# EAGLE design w_projectTQFP2 (EAGLE 6.3)
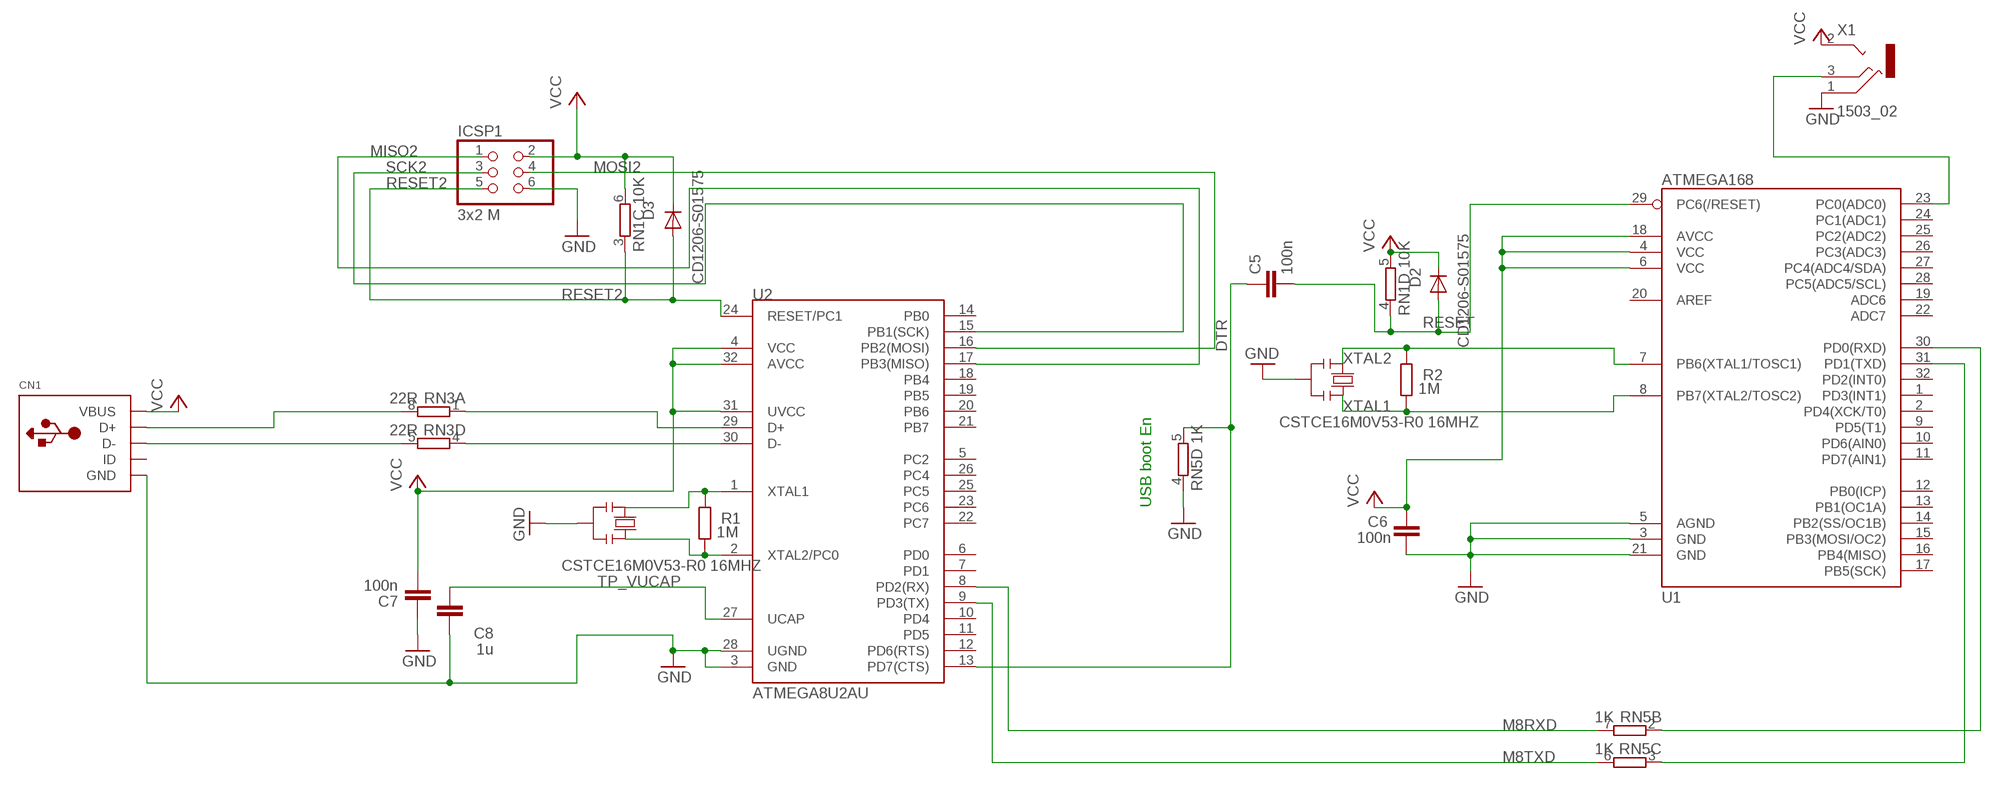
[diagram p0: schematic, sheet 1]

## Parts
C5  100n  C-EU0603-RND  [C0603-ROUND]
C6  100n  C-EU0603-RND  [C0603-ROUND]
C7  100n  C-EU0603-RND  [C0603-ROUND]
C8  1u  C-EU0603-RND  [C0603-ROUND]
CN1  USBMINIB  [USB-MINIB]
D2  CD1206-S01575  DIODE-MINIMELF  [MINIMELF]
D3  CD1206-S01575  DIODE-MINIMELF  [MINIMELF]
ICSP1  3x2 M  PINHD-2X3  [2X03]
R1  1M  R-EU_R0603  [R0603-ROUND]
R2  1M  R-EU_R0603  [R0603-ROUND]
RN1  10K  4R-NCAY16  [CAY16]
RN3  22R  4R-NCAY16  [CAY16]
RN5  1K  4R-NCAY16  [CAY16]
U1  ATMEGA168  [TQFP32-08]
U2  ATMEGA8U2AU  [TQFP32-08]
X1  1503_02  [1503_02]
Y2  CSTCE16M0V53-R0 16MHZ  RESONATORMU  [RESONATOR]
Y4  CSTCE16M0V53-R0 16MHZ  RESONATORMU  [RESONATOR]

## Nets
D+: CN1.D+ RN3.8
DTR: C5.1 RN5.5 U2.13(PD7(CTS))
GND [gnd]: C6.1 C7.2 C8.2 CN1.GND ICSP1.6 RN5.4 U1.3(GND) U1.5(AGND) U1.21(GND) U2.3(GND) U2.28(UGND) X1.1 Y2.2 Y4.2
IO1: RN5.3 U1.31(PD1(TXD))
M8RXD: RN5.7 U2.8(PD2(RX))
M8TXD: RN5.6 U2.9(PD3(TX))
MISO2: ICSP1.1 U2.17(PB3(MISO))
MOSI2: ICSP1.4 U2.16(PB2(MOSI))
N$1: RN5.2 U1.30(PD0(RXD))
N$2: U1.23(PC0(ADC0)) X1.3
N$3: RN3.1 U2.29(D+)
N$4: CN1.D- RN3.5
N$5: R1.1 U2.2(XTAL2/PC0) Y4.3
N$6: RN3.4 U2.30(D-)
N$7: R1.2 U2.1(XTAL1) Y4.1
RESET: C5.2 D2.A RN1.4 U1.29(PC6(/RESET))
RESET2: D3.A ICSP1.5 RN1.3 U2.24(RESET/PC1)
SCK2: ICSP1.3 U2.15(PB1(SCK))
TP_VUCAP: C8.1 U2.27(UCAP)
VCC [usbvcc]: C6.2 C7.1 CN1.VBUS D2.C D3.C ICSP1.2 RN1.5 RN1.6 U1.4(VCC) U1.6(VCC) U1.18(AVCC) U2.4(VCC) U2.31(UVCC) U2.32(AVCC) X1.2
XTAL1: R2.1 U1.8(PB7(XTAL2/TOSC2)) Y2.3
XTAL2: R2.2 U1.7(PB6(XTAL1/TOSC1)) Y2.1
Unconnected: CN1.ID RN1.1 RN1.2 RN1.7 RN1.8 RN3.2 RN3.3 RN3.6 RN3.7 RN5.1 RN5.8 U1.1(PD3(INT1)) U1.2(PD4(XCK/T0)) U1.9(PD5(T1)) U1.10(PD6(AIN0)) U1.11(PD7(AIN1)) U1.12(PB0(ICP)) U1.13(PB1(OC1A)) U1.14(PB2(SS/OC1B)) U1.15(PB3(MOSI/OC2)) U1.16(PB4(MISO)) U1.17(PB5(SCK)) U1.19(ADC6) U1.20(AREF) U1.22(ADC7) U1.24(PC1(ADC1)) U1.25(PC2(ADC2)) U1.26(PC3(ADC3)) U1.27(PC4(ADC4/SDA)) U1.28(PC5(ADC5/SCL)) U1.32(PD2(INT0)) U2.5(PC2) U2.6(PD0) U2.7(PD1) U2.10(PD4) U2.11(PD5) U2.12(PD6(RTS)) U2.14(PB0) U2.18(PB4) U2.19(PB5) U2.20(PB6) U2.21(PB7) U2.22(PC7) U2.23(PC6) U2.25(PC5) U2.26(PC4) X1.2@2

## Notes on the sheet
- USB boot En

## Library data of the parts
C5-C7 = SmartPrj:C-EU: CAPACITOR, European symbol; MF: AVX; MPN: 06033G104ZAT2A; OC_FARNELL: 317287
C8 = SmartPrj:C-EU: CAPACITOR, European symbol; MF: AVX; MPN: 1206YC105KAT2A; OC_FARNELL: 499717
CN1 = adafruit:USB: USB Connectors USBMINIB - Surface Mount Female Mini-B USB Connector 4UConnector: 06564 By microbuilder.eu Thru-hole RA Female Mini-B USB Connector 4UConnector: 18732 By ladyada.net; MF: MOLEX; MPN: 67503-1030; OC_FARNELL: 1507528
D2 D3 = diode:DIODE-: DIODE; MF: BOURNS; MPN: CD1206-S01575; OC_FARNELL: 7599821
ICSP1 = SmartPrj:PINHD-2X3: PIN HEADER; OC_FARNELL: unknown
R1 R2 = SmartPrj:R-EU_: RESISTOR, European symbol; MF: BOURNS; MPN: CR0603-JW-105GLF; OC_FARNELL: 2008367
RN1 = resistor-dil:4R-N: Array Chip Resistor Source: RS Component / Phycomp; MF: BOURNS; MPN: CAY16-1002F4LF.; OC_FARNELL: 1768294; OC_NEWARK: unknown
RN3 = resistor-dil:4R-N: Array Chip Resistor Source: RS Component / Phycomp; MF: BOURNS; MPN: CAY16-220J4LF; OC_FARNELL: 1770127; OC_NEWARK: unknown
RN5 = resistor-dil:4R-N: Array Chip Resistor Source: RS Component / Phycomp; MF: BOURNS; MPN: CAY16-102J4LF; OC_FARNELL: 1553319; OC_NEWARK: unknown
U1 = SparkFun:ATMEGA168; MF: ATMEL; MPN: ATMEGA328P-AU; OC_FARNELL: 1715486
U2 = SparkFun:ATMEGA8U2: Atmel 8-bit Microcontroller with 8/16/32K Bystes of ISP Flash and USB Controller. ATmega8U2, ATmega16U2, and ATmega32U2; MF: ATMEL; MPN: ATMEGA16U2-AU; OC_FARNELL: 1841607
X1 = con-lumberg:1503_02: Jack connectors according to JISC 6560, 3.5 mm Klinkeneinbaukupplung nach JISC 6560, 3,5 mm, 3-polig/stereo, abgewinkelte Ausführung, Surface-Mount-Technik (SMT) Source: http://www.lumberg.com/Produkte/PDFs/1503_02.pdf; MF: LUMBERG; MPN: 1503 02; OC_FARNELL: 1216979; OC_NEWARK: unknown
Y2 Y4 = SmartPrj:RESONATOR; MF: MURATA; MPN: CSTCE16M0V53-R0; OC_FARNELL: 1401454

## Net classes
0 default: width 0.254 mm, clearance 0.254 mm
1 power: width 0.61 mm, drill 0.61 mm, clearance 0.254 mm
2 gnd: width 0.305 mm, drill 0.559 mm, clearance 0.254 mm
3 usbvcc: width 0.508 mm, drill 0.61 mm, clearance 0.254 mm
4 aref: width 0.406 mm, drill 0.61 mm, clearance 0.254 mm

## Board
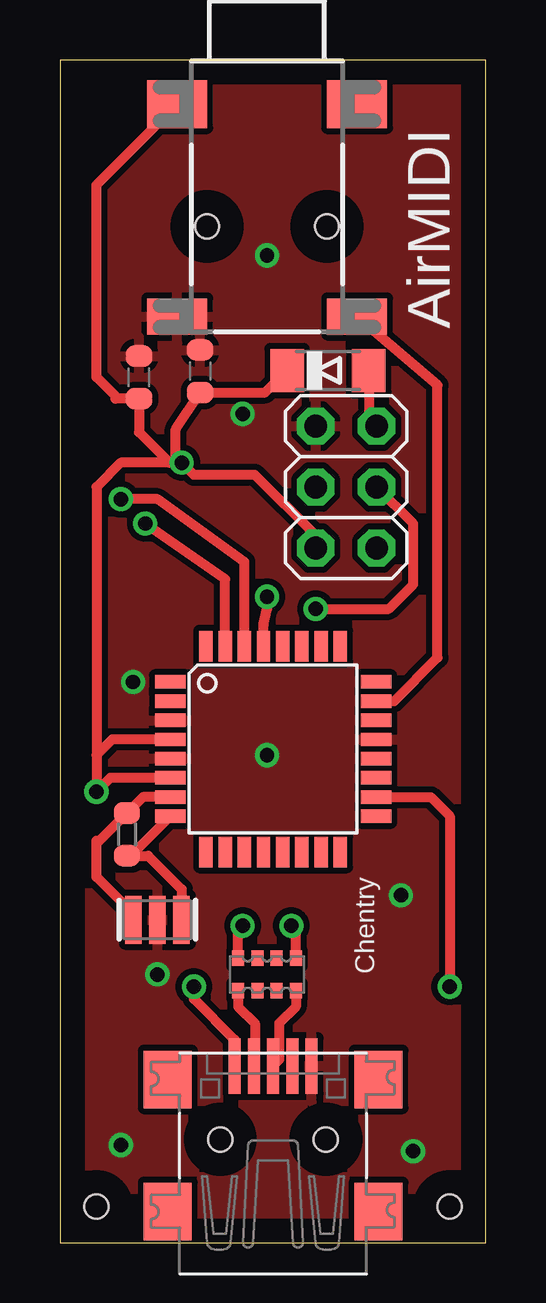
[diagram p1: board, top side]
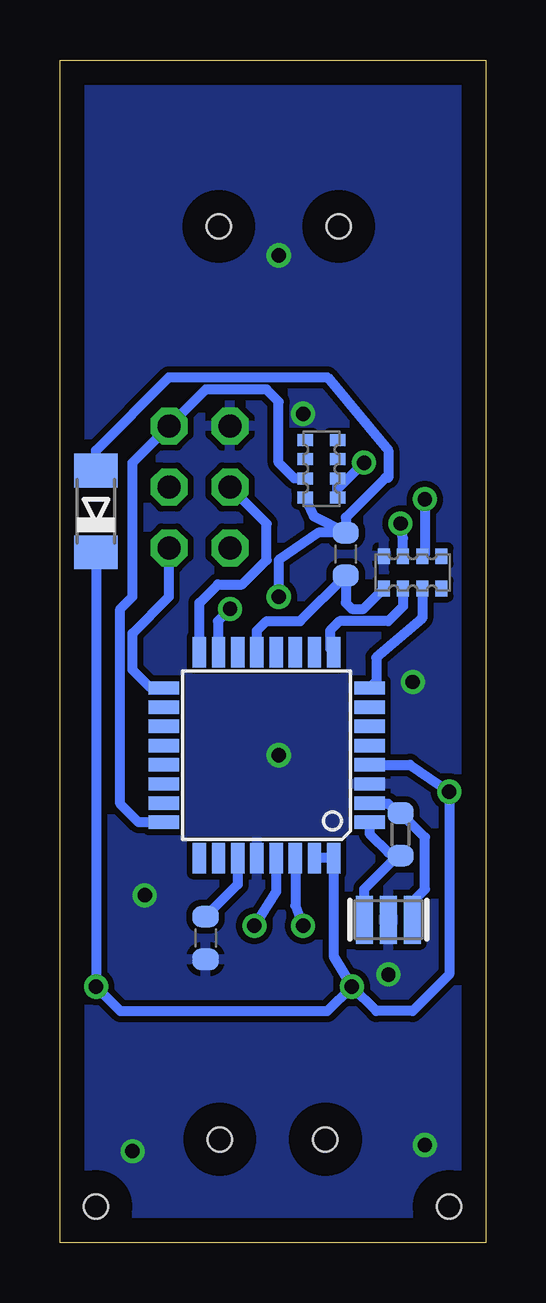
[diagram p2: board, bottom side, seen from below]

Size 17.76 x 49.31 mm. Coordinates in mm from the lower left corner, seen from the top.
Outline: 0,0 17.76,0 17.76,49.31 0,49.31 0,0
Copper layers (1*16): Top 0.035mm / dielectric 1.5mm / Bottom 0.035mm
Design rules "default": minimum track width 10mil, minimum drill 24mil, track to track 8mil, track to pad 8mil, pad to pad 8mil, via to via 8mil, smd to smd 8mil, copper to edge 40mil, drill to drill 8mil, minimum pad ring 10mil, minimum via ring 8mil, stop-mask expansion 4mil, vias tented up to drill 0mil, thermal gap 10mil
Holes 1 mm at 1.52,1.52 16.26,1.52

### Footprints (pad centres in the part's own frame; a part is rotated, then mirrored left to right if it is on the bottom)
C0603-ROUND = smd 0.898 x 1.1: 1 -0.889,0; 2 0.889,0
USB-MINIB = smd 0.5 x 2.308: D+ 0,4.064; D- -0.8,4.064; GND 1.6,4.064; ID 0.8,4.064; VBUS -1.6,4.064 | smd 2 x 2.4: GND1 -4.4,-2; GND2 -4.4,3.5; GND3 4.4,3.5; GND4 4.4,-2 | hole 1: -2.2,1; 2.2,1
MINIMELF = smd 1.4 x 1.8: A 1.7,0; C -1.7,0
2X03 = drill 0.95 pad 1.55 octagon: 1 -2.54,-1.27; 2 -2.54,1.27; 3 0,-1.27; 4 0,1.27; 5 2.54,-1.27; 6 2.54,1.27
R0603-ROUND = smd 0.898 x 1.1: 1 -0.889,0; 2 0.889,0
CAY16 = smd 0.5 x 0.65: 1 -1.2,-0.675; 2 -0.4,-0.675; 3 0.4,-0.675; 4 1.2,-0.675; 5 1.2,0.675; 6 0.4,0.675; 7 -0.4,0.675; 8 -1.2,0.675
TQFP32-08 = smd 1.27 x 0.559: 1 -4.293,2.8; 2 -4.293,2; 3 -4.293,1.2; 4 -4.293,0.4; 5 -4.293,-0.4; 6 -4.293,-1.2; 7 -4.293,-2; 8 -4.293,-2.8; 17 4.293,-2.8; 18 4.293,-2; 19 4.293,-1.2; 20 4.293,-0.4; 21 4.293,0.4; 22 4.293,1.2; 23 4.293,2; 24 4.293,2.8 | smd 0.559 x 1.27: 9 -2.8,-4.293; 10 -2,-4.293; 11 -1.2,-4.293; 12 -0.4,-4.293; 13 0.4,-4.293; 14 1.2,-4.293; 15 2,-4.293; 16 2.8,-4.293; 25 2.8,4.293; 26 2,4.293; 27 1.2,4.293; 28 0.4,4.293; 29 -0.4,4.293; 30 -1.2,4.293; 31 -2,4.293; 32 -2.8,4.293
1503_02 = smd 2.5 x 1.5: 1 -3.75,-10.75; 3 3.75,-10.75 | smd 2.5 x 2: 2 -3.75,-1.9; 2@2 3.75,-1.9 | hole 1: -2.5,-7; 2.5,-7
RESONATOR = smd 0.7 x 2: 1 -1,0; 2 0,0; 3 1,0

### Placement (x,y rotation side)
C5  5.84,28.72 90 bottom
C6  5.84,36.34 270 top
C7  3.3,36.08 90 top
C8  11.68,12.72 270 bottom
CN1  8.89,3.32 0 top
D2  16.26,30.5 90 bottom
D3  11.18,36.37 0 top
ICSP1  11.94,31.51 90 top
R1  3.56,17.03 270 bottom
R2  2.79,17.03 90 top
RN1  6.86,32.27 270 bottom
RN3  8.64,11.19 180 top
RN5  3.05,27.96 180 bottom
U1  8.89,20.59 0 top
U2  9.14,20.34 180 bottom
X1  8.64,49.37 0 top
Y2  4.06,13.48 0 top
Y4  4.06,13.48 0 bottom

### Tracks (layer width: path | path; a pad name or v marks a point on that pad's centre or on a via)
D+
  Top 0.406: RN3.8 9.84,9.85 9.14,9.16 9.14,7.64 CN1.D+
DTR
  Bottom 0.406: U2.13 9.54,25.52 9.14,25.92 7.75,25.92 C5.1 5.84,26.69 5.59,26.43 5.1,26.43 RN5.5
GND  (via drill 0.6)
  Top 0.406: U1.3 4.6,21.84 4.57,21.86
  other vias: 2.54,4.08 14.22,14.49 4.06,11.19 8.64,20.34 14.73,3.83 3.05,23.38 7.62,34.56 8.64,41.16
  pour Top: -1.27,-0.75 18.03,-0.75 18.03,49.8 -1.27,49.8
  pour Bottom: -1.27,-0.49 18.03,-0.49 18.03,49.8 -1.27,49.8
IO1  (via drill 0.6)
  Top 0.406: U1.31 6.89,27.67 v3.56,29.99
  Bottom 0.406: RN5.3 3.45,29.37 v3.56,29.99
M8RXD
  Bottom 0.406: RN5.7 2.65,26.03 4.57,24.4 4.57,23.38 4.6,23.38 U2.8
M8TXD
  Bottom 0.406: RN5.6 3.45,26.54 4.06,25.92 6.1,25.92 6.5,25.52 6.5,24.78 U2.9
MISO2
  Bottom 0.406: U2.17 13.98,23.14 14.73,23.89 14.73,25.42 13.21,26.94 ICSP1.1
MOSI2
  Bottom 0.406: U2.16 11.94,26.68 11.18,27.45 10.16,27.45 9.14,28.46 9.14,29.99 ICSP1.4
N$1  (via drill 0.6)
  Top 0.406: U1.30 7.69,28.39 4.06,31 v2.54,31
  Bottom 0.406: v2.54,31 2.54,28.74 RN5.2
N$2
  Top 0.406: U1.23 13.94,22.59 15.75,24.4 15.75,35.75 X1.3
N$3  (via drill 0.6)
  Top 0.406: RN3.1 9.84,13.04 v9.65,13.22
  Bottom 0.406: U2.29 8.74,14.64 v9.65,13.22
N$4
  Top 0.406: RN3.5 7.44,9.85 8.13,9.16 8.13,7.42 CN1.D-
N$5
  Bottom 0.406: Y4.3 3.17,14.1 3.17,14.11 2.54,14.75 2.54,16.91 R1.1 3.68,17.92 4.06,18.3 4.82,18.3 U2.2
N$6  (via drill 0.6)
  Top 0.406: RN3.4 7.44,13.04 v7.62,13.22
  Bottom 0.406: U2.30 7.94,14.06 v7.62,13.22
N$7
  Bottom 0.406: U2.1 4.85,17.06 4.06,16.27 3.68,16.27 R1.2 3.68,16.14 5.08,14.75 5.08,13.49 Y4.1
RESET  (via drill 0.6)
  Top 0.406: U1.29 8.49,25.78 8.64,26.43 v8.64,26.94
  Bottom 0.406: RN1.4 7.18,30.3 C5.2 | C5.2 6.99,29.61 8.64,28.46 v8.64,26.94 | D2.A 16.26,33.04 13.21,36.08 6.6,36.08 4.06,33.04 4.06,31.89 4.19,31.89 5.84,30.24 C5.2
RESET2
  Top 0.406: D3.A 12.88,34.38 ICSP1.5
  Bottom 0.406: U2.24 14.47,17.54 15.24,18.3 15.24,26.43 14.73,26.94 14.73,32.53 ICSP1.5 11.68,35.58 9.14,35.58 8.64,35.07 8.64,32.53 7.98,31.87 RN1.3
SCK2  (via drill 0.6)
  Top 0.406: ICSP1.3 14.73,29.99 14.73,27.45 13.72,26.43 v10.67,26.43
  Bottom 0.406: v10.67,26.43 11.18,25.92 11.18,24.91 U2.15
TP_VUCAP
  Bottom 0.406: U2.27 10.34,14.95 C8.1
VCC  (via drill 0.6)
  Top 0.406: CN1.VBUS 7.29,8.47 5.59,10.18 v5.59,10.68 | U1.4 2.18,20.99 1.52,20.34 v1.52,18.81 | U1.18 15.46,18.59 16.26,17.8 v16.26,10.68 | ICSP1.2 10.67,29.48 8.13,32.02 5.59,32.02 v5.08,32.53 | v5.08,32.53 4.57,32.53 | 4.57,32.53 2.54,32.53 1.52,31.51 v1.52,18.81 | v5.08,32.53 4.83,32.78 4.83,33.93 C6.2 8.55,35.45 D3.C | 4.57,32.53 3.3,33.8 C7.1 2.31,35.2 2.31,35.3 1.52,36.08 1.52,44.11 X1.2 | U1.6 2.1,19.39 v1.52,18.81
  Bottom 0.406: U2.31 U2.32 6.34,11.95 v5.59,10.68 | U2.4 3.16,19.94 v1.52,18.81 1.52,11.19 3.05,9.67 4.57,9.67 v5.59,10.68 | v5.59,10.68 6.6,9.67 15.24,9.67 v16.26,10.68 D2.C | RN1.5 6.18,31.51 | 6.18,31.51 RN1.6 | v5.08,32.53 6.1,31.51 6.18,31.51
XTAL1
  Top 0.406: R2.1 2.95,16.14 | 2.95,16.14 U1.8 | 2.95,16.14 3.68,16.14 5.08,14.75 5.08,13.49 Y2.3
XTAL2
  Top 0.406: Y2.1 3.06,13.72 1.52,15.26 1.52,16.78 1.65,16.78 R2.2 3.46,18.59 U1.7

### Text on the board
tPlace: AirMIDI | Chentry